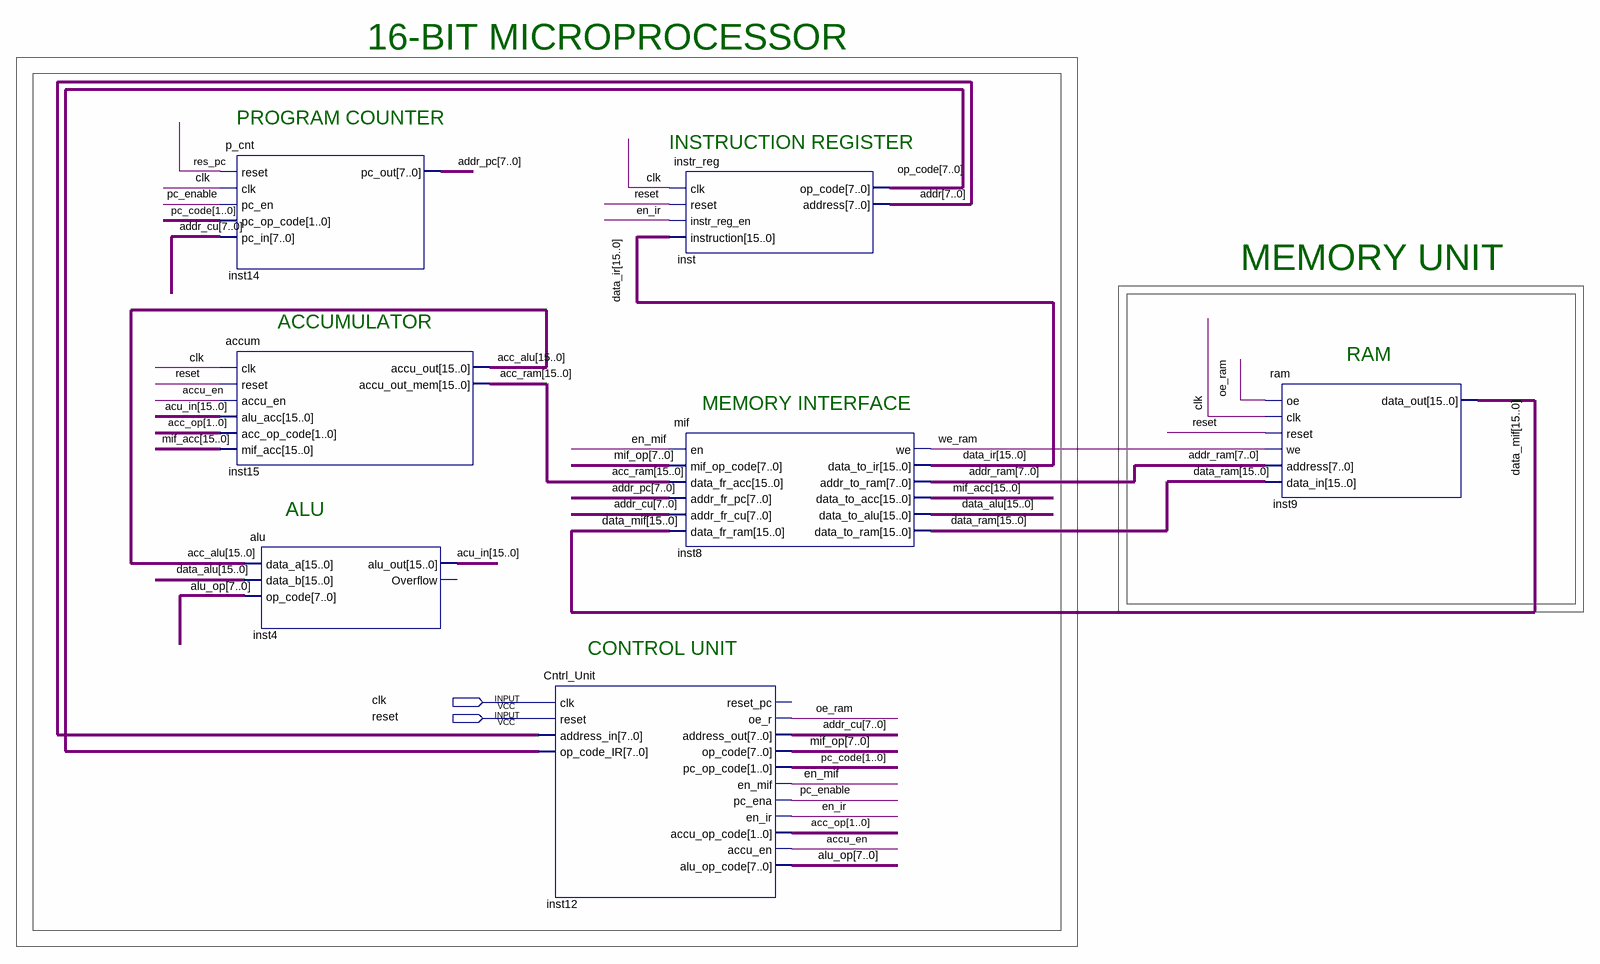
[diagram p0: schematic sheet]
// Quartus schematic main_design.bdf as structural Verilog: 7 symbols, 2 pins
module main_design (
  input  clk,
  input  reset
);

  wire accu_en, en_ir, en_mif, oe_ram, pc_enable, res_pc, we_ram;
  wire [1:0] acc_op, pc_code;
  wire [7:0] addr, addr_cu, addr_pc, addr_ram, alu_op, mif_op, op_code;
  wire [15:0] acc_alu, acc_ram, acu_in, data_alu, data_ir, data_mif, data_ram, mif_acc;

  p_cnt inst14 (.reset(res_pc), .clk(clk), .pc_en(pc_enable), .pc_op_code(pc_code), .pc_in(addr_cu), .pc_out(addr_pc));
  accum inst15 (
    .clk(clk), .reset(reset), .accu_en(accu_en), .alu_acc(acu_in), .acc_op_code(acc_op), .mif_acc(mif_acc),
    .accu_out(acc_alu), .accu_out_mem(acc_ram));
  alu inst4 (.data_a(acc_alu), .data_b(data_alu), .op_code(alu_op), .alu_out(acu_in));  // open: Overflow
  Cntrl_Unit inst12 (
    .clk(clk), .reset(reset), .address_in(addr), .op_code_IR(op_code), .oe_r(oe_ram), .address_out(addr_cu),
    .op_code(mif_op), .pc_op_code(pc_code), .en_mif(en_mif), .pc_ena(pc_enable), .en_ir(en_ir),
    .accu_op_code(acc_op), .accu_en(accu_en), .alu_op_code(alu_op));  // open: reset_pc
  instr_reg inst (
    .clk(clk), .reset(reset), .instr_reg_en(en_ir), .instruction(data_ir), .op_code(op_code), .address(addr));
  mif inst8 (
    .en(en_mif), .mif_op_code(mif_op), .data_fr_acc(acc_ram), .addr_fr_pc(addr_pc), .addr_fr_cu(addr_cu),
    .data_fr_ram(data_mif), .we(we_ram), .data_to_ir(data_ir), .addr_to_ram(addr_ram), .data_to_acc(mif_acc),
    .data_to_alu(data_alu), .data_to_ram(data_ram));
  ram inst9 (
    .oe(oe_ram), .clk(clk), .reset(reset), .we(we_ram), .address(addr_ram), .data_in(data_ram),
    .data_out(data_mif));

  // Notes on the sheet:
  //   16-BIT MICROPROCESSOR
  //   PROGRAM COUNTER
  //   INSTRUCTION REGISTER
  //   MEMORY UNIT
  //   ACCUMULATOR
  //   RAM
  //   MEMORY INTERFACE
  //   ALU
  //   CONTROL UNIT
endmodule
